# EAGLE schematic UDOO_CONNECTIVITY_SHIELD_v1 (EAGLE 7.1.0)
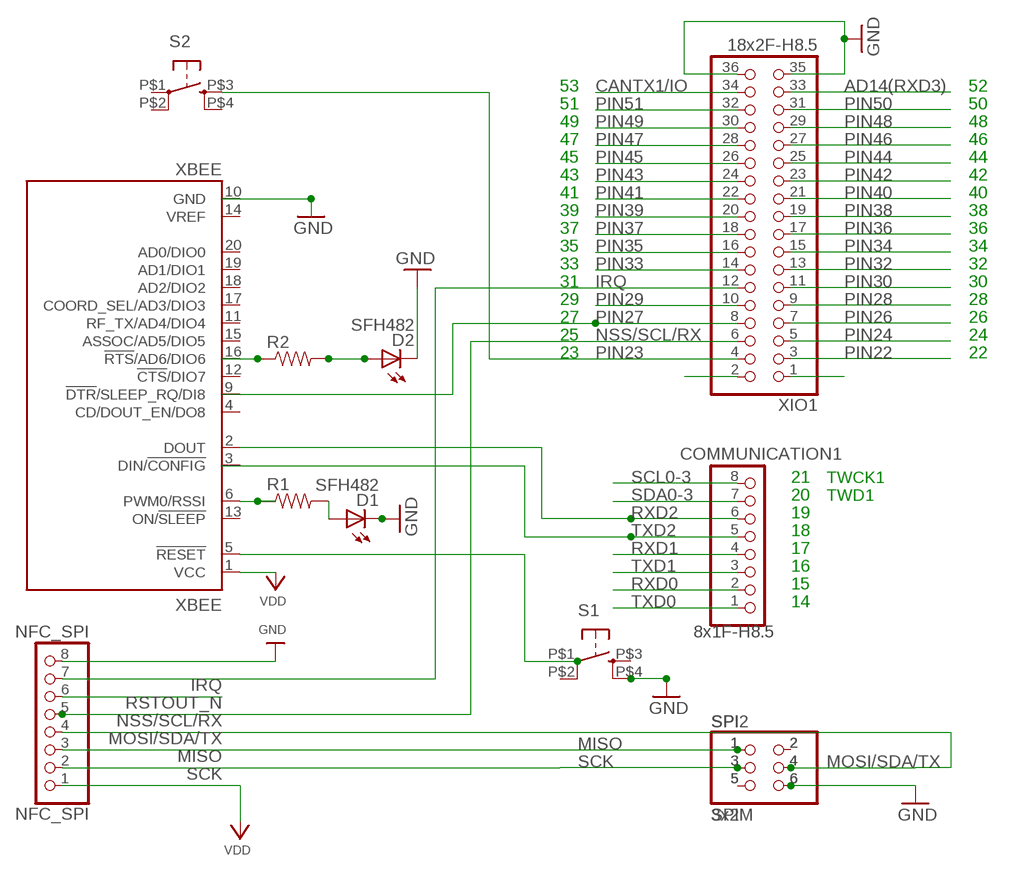
[diagram p0: schematic, sheet 1]

## Parts
COMMUNICATION1  8x1F-H8.5  PINHD-1X8  [1X08]
D1  SFH482  [SFH482]
D2  SFH482  [SFH482]
NFC_SPI  NFC_SPI  HEADER-1X8ROUND  [1X08_ROUND]
R1  RESISTORPTH-1/6W  [1/6W-RES]
R2  RESISTORPTH-1/6W  [1/6W-RES]
S1  TAC_SWITCHKSA_SEALED  [KSA_SEALED_TAC_SWITCH]
S2  TAC_SWITCHKSA_SEALED  [KSA_SEALED_TAC_SWITCH]
SPI  SPI  PINHD-2X3  [2X03]
SPI2  3x2M  PINHD-2X3  [2X03]
XBEE  XBEE  [XBEE]
XIO1  18x2F-H8.5  PINHD-2X18  [2X18]

## Nets
+5V1: XIO1.1
AD14(RXD3): XIO1.33
CANTX1/IO: XIO1.34
GND: D1.K(C) D2.K(C) NFC_SPI.8 S1.P$4 SPI2.6 SPI.6 XIO1.35 XIO1.36
IRQ: NFC_SPI.7 XIO1.12
MASTER-RESET: SPI2.5 SPI.5
MISO: NFC_SPI.3 SPI2.1 SPI.1
MOSI/SDA/TX: NFC_SPI.4 SPI2.4 SPI.4
N$1: XIO1.2
N$2: R2.1
N$3: XBEE.5(!RESET)
N$4: D2.A R2.2
N$5: SPI2.2 SPI.2
N$6: R1.1 XBEE.6(PWM0/RSSI)
N$7: D1.A R1.2
NSS/SCL/RX: NFC_SPI.5 XIO1.6
PIN22: XIO1.3
PIN23: S2.P$3 XIO1.4
PIN24: XIO1.5
PIN26: XIO1.7
PIN27: XIO1.8
PIN28: XIO1.9
PIN29: XIO1.10
PIN30: XIO1.11
PIN32: XIO1.13
PIN33: XIO1.14
PIN34: XIO1.15
PIN35: XIO1.16
PIN36: XIO1.17
PIN37: XIO1.18
PIN38: XIO1.19
PIN39: XIO1.20
PIN40: XIO1.21
PIN41: XIO1.22
PIN42: XIO1.23
PIN43: XIO1.24
PIN44: XIO1.25
PIN45: XIO1.26
PIN46: XIO1.27
PIN47: XIO1.28
PIN48: XIO1.29
PIN49: XIO1.30
PIN50: XIO1.31
PIN51: XIO1.32
RSTOUT_N: NFC_SPI.6
RXD0: COMMUNICATION1.2
RXD1: COMMUNICATION1.4
RXD2: COMMUNICATION1.6 XBEE.2(DOUT)
SCK: NFC_SPI.2 SPI2.3 SPI.3
SCL0-3: COMMUNICATION1.8
SDA0-3: COMMUNICATION1.7
TXD0: COMMUNICATION1.1
TXD1: COMMUNICATION1.3
TXD2: COMMUNICATION1.5
VDD: NFC_SPI.1 XBEE.1(VCC)
Unconnected: S1.P$1 S1.P$2 S1.P$3 S2.P$1 S2.P$2 S2.P$4 XBEE.3(DIN/!CONFIG) XBEE.4(CD/DOUT_EN/DO8) XBEE.9(!DTR!/SLEEP_RQ/DI8) XBEE.11(RF_TX/AD4/DIO4) XBEE.12(!CTS!/DIO7) XBEE.13(ON/!SLEEP) XBEE.14(VREF) XBEE.15(ASSOC/AD5/DIO5) XBEE.16(!RTS!/AD6/DIO6) XBEE.17(COORD_SEL/AD3/DIO3) XBEE.18(AD2/DIO2) XBEE.19(AD1/DIO1) XBEE.20(AD0/DIO0)

## Notes on the sheet
- 53 | 52
- 51 | 50
- 49 | 48
- 47 | 46
- 45 | 44
- 43 | 42
- 41 | 40
- 39 | 38
- 37 | 36
- 35 | 34
- 33 | 32
- 31 | 30
- 29 | 28
- 27 | 26
- 25 | 24
- 23 | 22
- 21 | TWCK1
- 20 | TWD1
- 19
- 18
- 17
- 16
- 15
- 14

## Power pins joined to a net without a drawn wire
GND: XBEE.10(GND)

## Library data of the parts
COMMUNICATION1 = SmartPrj:PINHD-1X8: PIN HEADER
D1 D2 = led:SFH482: IR LED infrared emitting diode, Infineon
NFC_SPI = microbuilder:HEADER-1X8: PIN HEADER
R1 R2 = SparkFun-Passives:RESISTOR: Resistor Basic schematic elements and footprints for 0603, 1206, and PTH resistors.
S1 S2 = SparkFun-Retired:TAC_SWITCH: Momentary Switch Button commonly used for reset or general input. Spark Fun Electronics SKU : COM-00097 SMT- SWCH-08247
SPI SPI2 = SmartPrj:PINHD-2X3: PIN HEADER
XBEE = maxstream:XBEE: XBee (TM) /XBee-PRO(TM) OEM RF Modules Source: MaxStream, Inc. xbee_productmanual.pdf; MPN: XBP24-Z7UIT-004; OC_FARNELL: 1751799; OC_NEWARK: 34R5507
XIO1 = SmartPrj:PINHD-2X18: PIN HEADER

## Net classes
1 USB: width 0.203 mm, drill 0.406 mm, clearance 0.203 mm
2 gnd: width 0.203 mm, drill 0.406 mm, clearance 0.203 mm
3 usbvcc: width 0.203 mm, drill 0.406 mm, clearance 0.203 mm
4 USBpair: width 0.254 mm, drill 0.406 mm, clearance 0.61 mm